# EAGLE schematic thinkingcap10b (EAGLE 6.2)
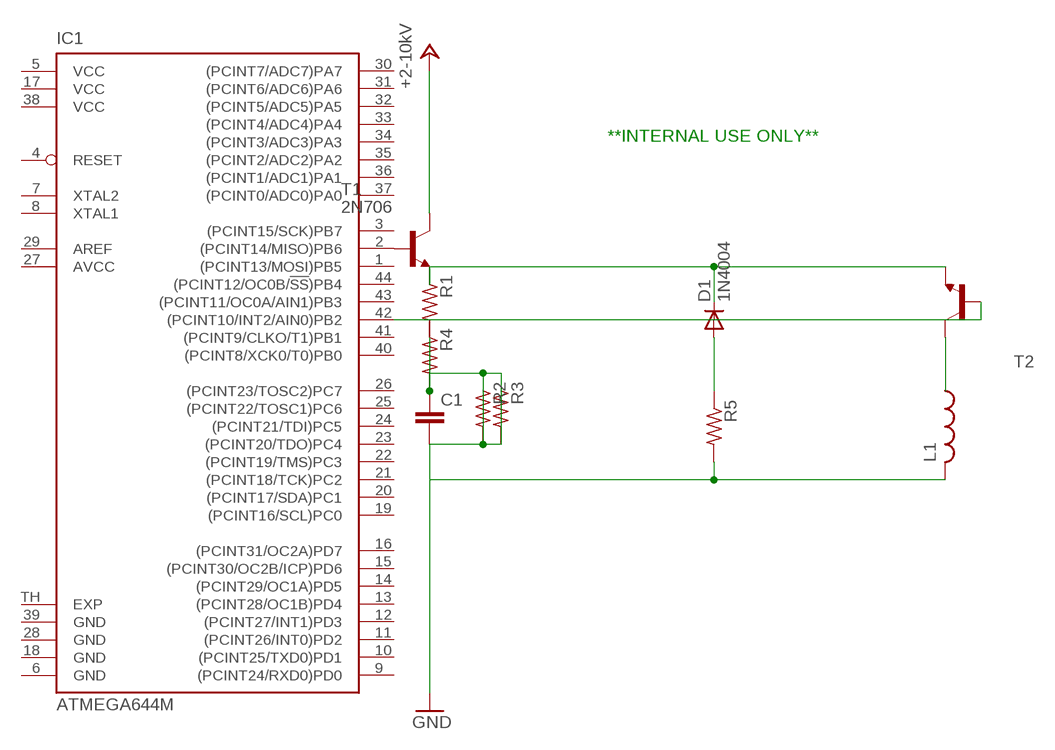
[diagram p0: schematic, sheet 1]

## Parts
C1  C-EU025-024X044  [C025-024X044]
D1  1N4004  [DO41-10]
IC1  ATMEGA644M  [MLF44-TH]
L1  L-US0204/5  [0204/5]
R1  R-US_0204/2V  [0204V]
R2  R-US_0204/2V  [0204V]
R3  R-US_0204/2V  [0204V]
R4  R-US_0204/2V  [0204V]
R5  R-US_0204/2V  [0204V]
T1  2N706  [TO18]
T2  -NPN-SOT23-EBC  [SOT23-EBC]

## Nets
+24V: T1.3(C) ; supply symbol labelled +2-10kV
GND: C1.1 C1.2 L1.2 R1.2 R2.1 R2.2 R3.1 R3.2 R4.2 R5.2
N$1: IC1.2((PCINT14/MISO)PB6) T1.2(B)
N$2: D1.C
N$3: D1.A R5.1
N$4: R1.1 T1.1(E) T2.E
N$5: T2.C
N$6: IC1.42((PCINT10/INT2/AIN0)PB2) T2.B
Unconnected: IC1.1((PCINT13/MOSI)PB5) IC1.3((PCINT15/SCK)PB7) IC1.4(RESET) IC1.7(XTAL2) IC1.8(XTAL1) IC1.9((PCINT24/RXD0)PD0) IC1.10((PCINT25/TXD0)PD1) IC1.11((PCINT26/INT0)PD2) IC1.12((PCINT27/INT1)PD3) IC1.13((PCINT28/OC1B)PD4) IC1.14((PCINT29/OC1A)PD5) IC1.15((PCINT30/OC2B/ICP)PD6) IC1.16((PCINT31/OC2A)PD7) IC1.19((PCINT16/SCL)PC0) IC1.20((PCINT17/SDA)PC1) IC1.21((PCINT18/TCK)PC2) IC1.22((PCINT19/TMS)PC3) IC1.23((PCINT20/TDO)PC4) IC1.24((PCINT21/TDI)PC5) IC1.25((PCINT22/TOSC1)PC6) IC1.26((PCINT23/TOSC2)PC7) IC1.29(AREF) IC1.30((PCINT7/ADC7)PA7) IC1.31((PCINT6/ADC6)PA6) IC1.32((PCINT5/ADC5)PA5) IC1.33((PCINT4/ADC4)PA4) IC1.34((PCINT3/ADC3)PA3) IC1.35((PCINT2/ADC2)PA2) IC1.36((PCINT1/ADC1)PA1) IC1.37((PCINT0/ADC0)PA0) IC1.40((PCINT8/XCK0/T0)PB0) IC1.41((PCINT9/CLKO/T1)PB1) IC1.43((PCINT11/OC0A/AIN1)PB3) IC1.44((PCINT12/OC0B/!SS!)PB4) L1.1 R4.1

## Notes on the sheet
- **INTERNAL USE ONLY**

## Power pins joined to a net without a drawn wire
AVCC: IC1.27(AVCC)
EXP: IC1.TH(EXP)
GND: IC1.6(GND) IC1.18(GND) IC1.28(GND) IC1.39(GND)
VCC: IC1.5(VCC) IC1.17(VCC) IC1.38(VCC)

## Library data of the parts
C1 = rcl:C-EU: CAPACITOR, European symbol
D1 = diode:1N4004: DIODE general purpose rectifier, 1 A
IC1 = atmel:ATMEGA644*: 8-bit Microcontroller with 64K Bytes In-System Programmable Flash Source: http://www.atmel.com/dyn/resources/prod_documents/doc2593.pdf; MPN: ATMEGA644P-20MU; OC_FARNELL: 1748528; OC_NEWARK: 26R5636
L1 = rcl:L-US: INDUCTOR, American symbol
R1-R5 = rcl:R-US_: RESISTOR, American symbol
T1 = transistor:2N706: NPN TRANSISTOR
T2 = transistor:*-NPN-: NPN Transistror BF959 corrected 2008.03.06